# EAGLE design light (EAGLE 7.6.0)
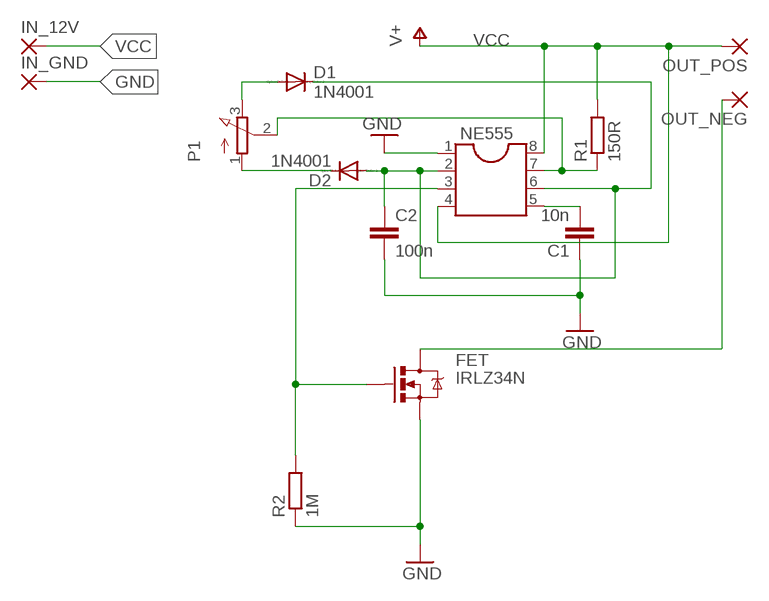
[diagram p0: schematic, sheet 1]

## Parts
C1  10n  C-EU025-024X044  [C025-024X044]
C2  100n  C-EU025-024X044  [C025-024X044]
D1  1N4001  DIODE-DO41-10  [DO41-10]
D2  1N4001  DIODE-DO41-10  [DO41-10]
FET  IRLZ34N  [TO-220(2)]
IN_12V  3,81/1,3  [3,81/1,3]
IN_GND  3,81/1,3  [3,81/1,3]
NE555  DIL8  [DIL08]
OUT_NEG  3,81/1,1  [3,81/1,1]
OUT_POS  3,81/1,1  [3,81/1,1]
P1  3RP/1610N  [3RP/1610N]
R1  150R  R-EU_0207/7  [0207/7]
R2  1M  R-EU_0207/7  [0207/7]

## Nets
GND: C1.1 C2.2 FET.OUT(S) IN_GND.1(P) NE555.1 R2.1
N$2: D2.C P1.1(A)
N$3: NE555.7 P1.2(S) R1.1
N$4: D1.A P1.3(E)
N$5: C1.2 NE555.5
N$6: FET.IN(G) NE555.3 R2.2
N$7: FET.GND(D) OUT_NEG.1(P)
N$8: C2.1 D1.C D2.A NE555.2 NE555.6
VCC: IN_12V.1(P) NE555.4 NE555.8 OUT_POS.1(P) R1.2 ; supply symbol labelled V+

## Library data of the parts
C1 C2 = resistor:C-EU: CAPACITOR, European symbol
D1 D2 = diode:DIODE-: DIODE
FET = IRLZ34N:IRLZ34N; AVAILABILITY: Unavailable; DESCRIPTION: N-Channel 55V 30A (Tc) 3.8W (Ta), 68W (Tc) Surface Mount D2PAK; MF: Infineon Technologies; MP: IRLZ34N; PACKAGE: TO-263-3 Infineon Technologies; PRICE: None
IN_12V IN_GND = wirepad:3,81/1,3: THROUGH-HOLE PAD
NE555 = ic-package:DIL8: Dual In Line / Socket
OUT_NEG OUT_POS = wirepad:3,81/1,1: THROUGH-HOLE PAD
P1 = pot:3RP/1610N: 16mm Potentiometer one level Source: http://www.alphapotentiometers.net/html/16mm_pot_2.html
R1 R2 = resistor:R-EU_: RESISTOR, European symbol

## Board
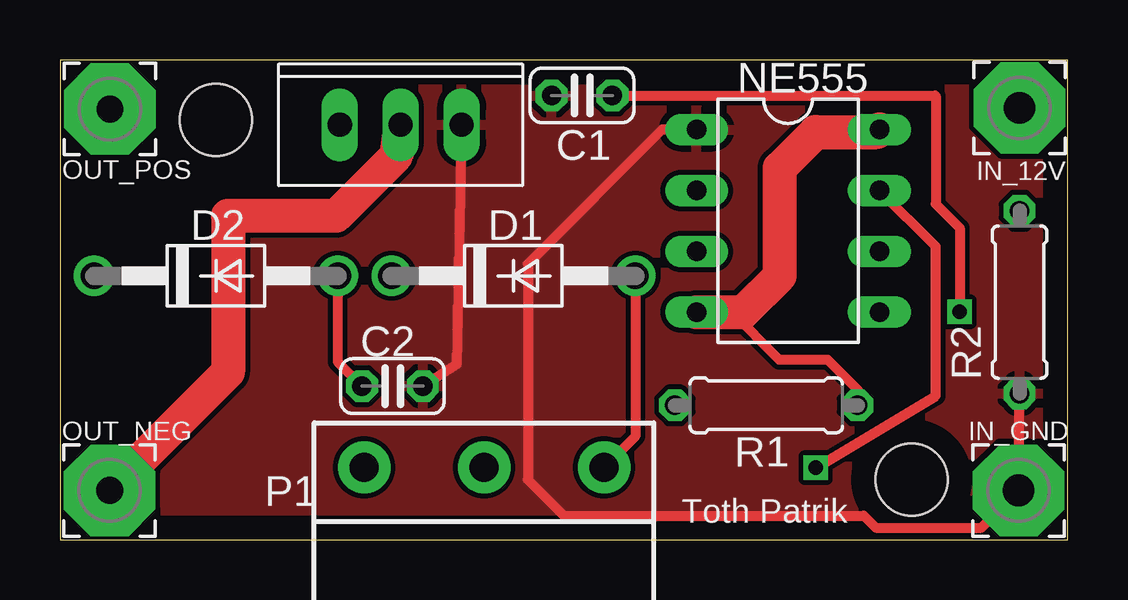
[diagram p1: board, top side]
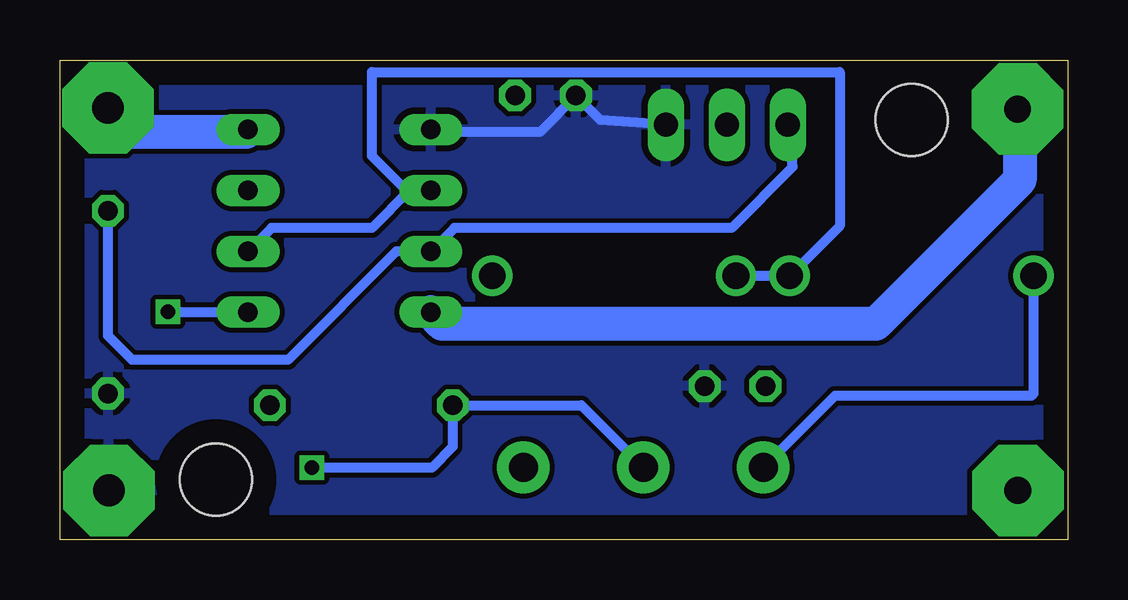
[diagram p2: board, bottom side, seen from below]

Size 42 x 20 mm. Coordinates in mm from the lower left corner, seen from the top.
Outline: 0,0 42,0 42,20 0,20 0,0
Copper layers (1*16): Top 0.035mm / dielectric 1.5mm / Bottom 0.035mm
Design rules "default": minimum track width 10mil, minimum drill 24mil, track to track 8mil, track to pad 8mil, pad to pad 8mil, via to via 8mil, smd to smd 8mil, copper to edge 40mil, drill to drill 8mil, minimum pad ring 10mil, minimum via ring 8mil, stop-mask expansion 4mil, vias tented up to drill 0mil, thermal gap 10mil
Holes 3 mm at 6.5,17.5 35.5,2.5

### Footprints (pad centres in the part's own frame; a part is rotated, then mirrored left to right if it is on the bottom)
C025-024X044 = drill 0.813 octagon: 1 -1.27,0; 2 1.27,0
DO41-10 = drill 1.118: A 5.08,0; C -5.08,0
TO-220(2) = drill 1.016 long: GND 0,0; IN -2.54,0; OUT 2.54,0
3,81/1,3 = drill 1.321 pad 3.81 octagon: 1 0,0
DIL08 = drill 0.813 long: 1 -3.81,-3.81; 2 -1.27,-3.81; 3 1.27,-3.81; 4 3.81,-3.81; 5 3.81,3.81; 6 1.27,3.81; 7 -1.27,3.81; 8 -3.81,3.81
3,81/1,1 = drill 1.118 pad 3.81 octagon: 1 0,0
3RP/1610N = drill 1.2 pad 2.184: 1 -5,3.54; 2 0,3.54; 3 5,3.54
0207/7 = drill 0.813 octagon: 1 -3.81,0; 2 3.81,0

### Placement (x,y rotation side)
C1  21.76,18.52 0 top
C2  13.86,6.4 0 top
D1  18.9,11 0 top
D2  6.5,11 0 top
FET  14.2,17.3 0 top
IN_12V  40,18 0 top
IN_GND  39.96,2.05 0 top
NE555  30.35,13.29 270 top
OUT_NEG  2.07,2.05 0 top
OUT_POS  2.08,17.95 0 top
P1  17.68,-0.53 0 top
R1  29.44,5.6 0 top
R2  40,9.9 90 top

### Tracks (layer width: path | path; a pad name or v marks a point on that pad's centre or on a via)
GND
  Top 0.406: FET.OUT 16.54,7.31 C2.2 | NE555.1 25.1,17.1 19.5,11.5 19.5,2.5 21,1 33.5,1 34,0.5 38.41,0.5 IN_GND.1 39.96,6.09 R2.1
  Bottom 0.406: FET.OUT 19.47,17.5 C1.1 22,17 26.44,17 NE555.1
  pour Top: 0,20 0,0 42,0 42,20
  pour Bottom: 0,20 0,0 42,0 42,20
N$2
  Bottom 0.406: D2.C 1.42,6.08 1.5,6 9.69,6 P1.1
N$3  (via drill 0.6)
  Top 0.406: v31.5,3 36.5,6 36.5,12.22 NE555.7
  Bottom 0.406: P1.2 20.27,5.6 R1.1 25.63,3.87 26.5,3 v31.5,3
N$4
  Top 0.406: D1.A 23.98,4.31 P1.3
N$5  (via drill 0.6)
  Top 0.406: C1.2 36.48,18.52 36.5,18.5 36.5,14 37.5,13 v37.5,9.5
  Bottom 0.406: v37.5,9.5 34.18,9.5 NE555.5
N$6
  Bottom 0.406: FET.IN 11.46,15.54 14,13 25.56,13 NE555.3 27.98,12.02 32.5,7.5 39,7.5 40,8.5 R2.2
N$7
  Top 1.422: FET.GND 14,16 11.5,13.5 7,13.5 7,6.98 OUT_NEG.1
N$8
  Top 0.406: D2.A 11.58,7.41 C2.1
  Bottom 0.406: D1.C D2.A 9.5,13.08 9.5,19.5 29,19.5 29,16 27.56,14.56 NE555.2 27.44,14.56 29,13 33.18,13 NE555.6
VCC
  Top 0.406: R1.2 33.25,6.25 32,7.5 29.98,7.5 28,9.48
  Top 1.422: NE555.4 28,9.48 28.48,9.48 30,11 30,15.5 31.5,17 34.06,17 NE555.8
  Bottom 0.406: 26.52,9.5 NE555.4 | 34.26,17 NE555.8
  Bottom 1.422: OUT_POS.1 2,17.95 2,15 8,9 26.06,9 NE555.4 | 34.26,17 39,17 IN_12V.1

### Text on the board
tNames: Toth Patrik